# Altium schematic sheet 2020年电赛校赛电源板.SchDoc
size A4; DocumentNumber: 2; Revision: V2.0; SheetNumber: 2; SheetTotal: 5
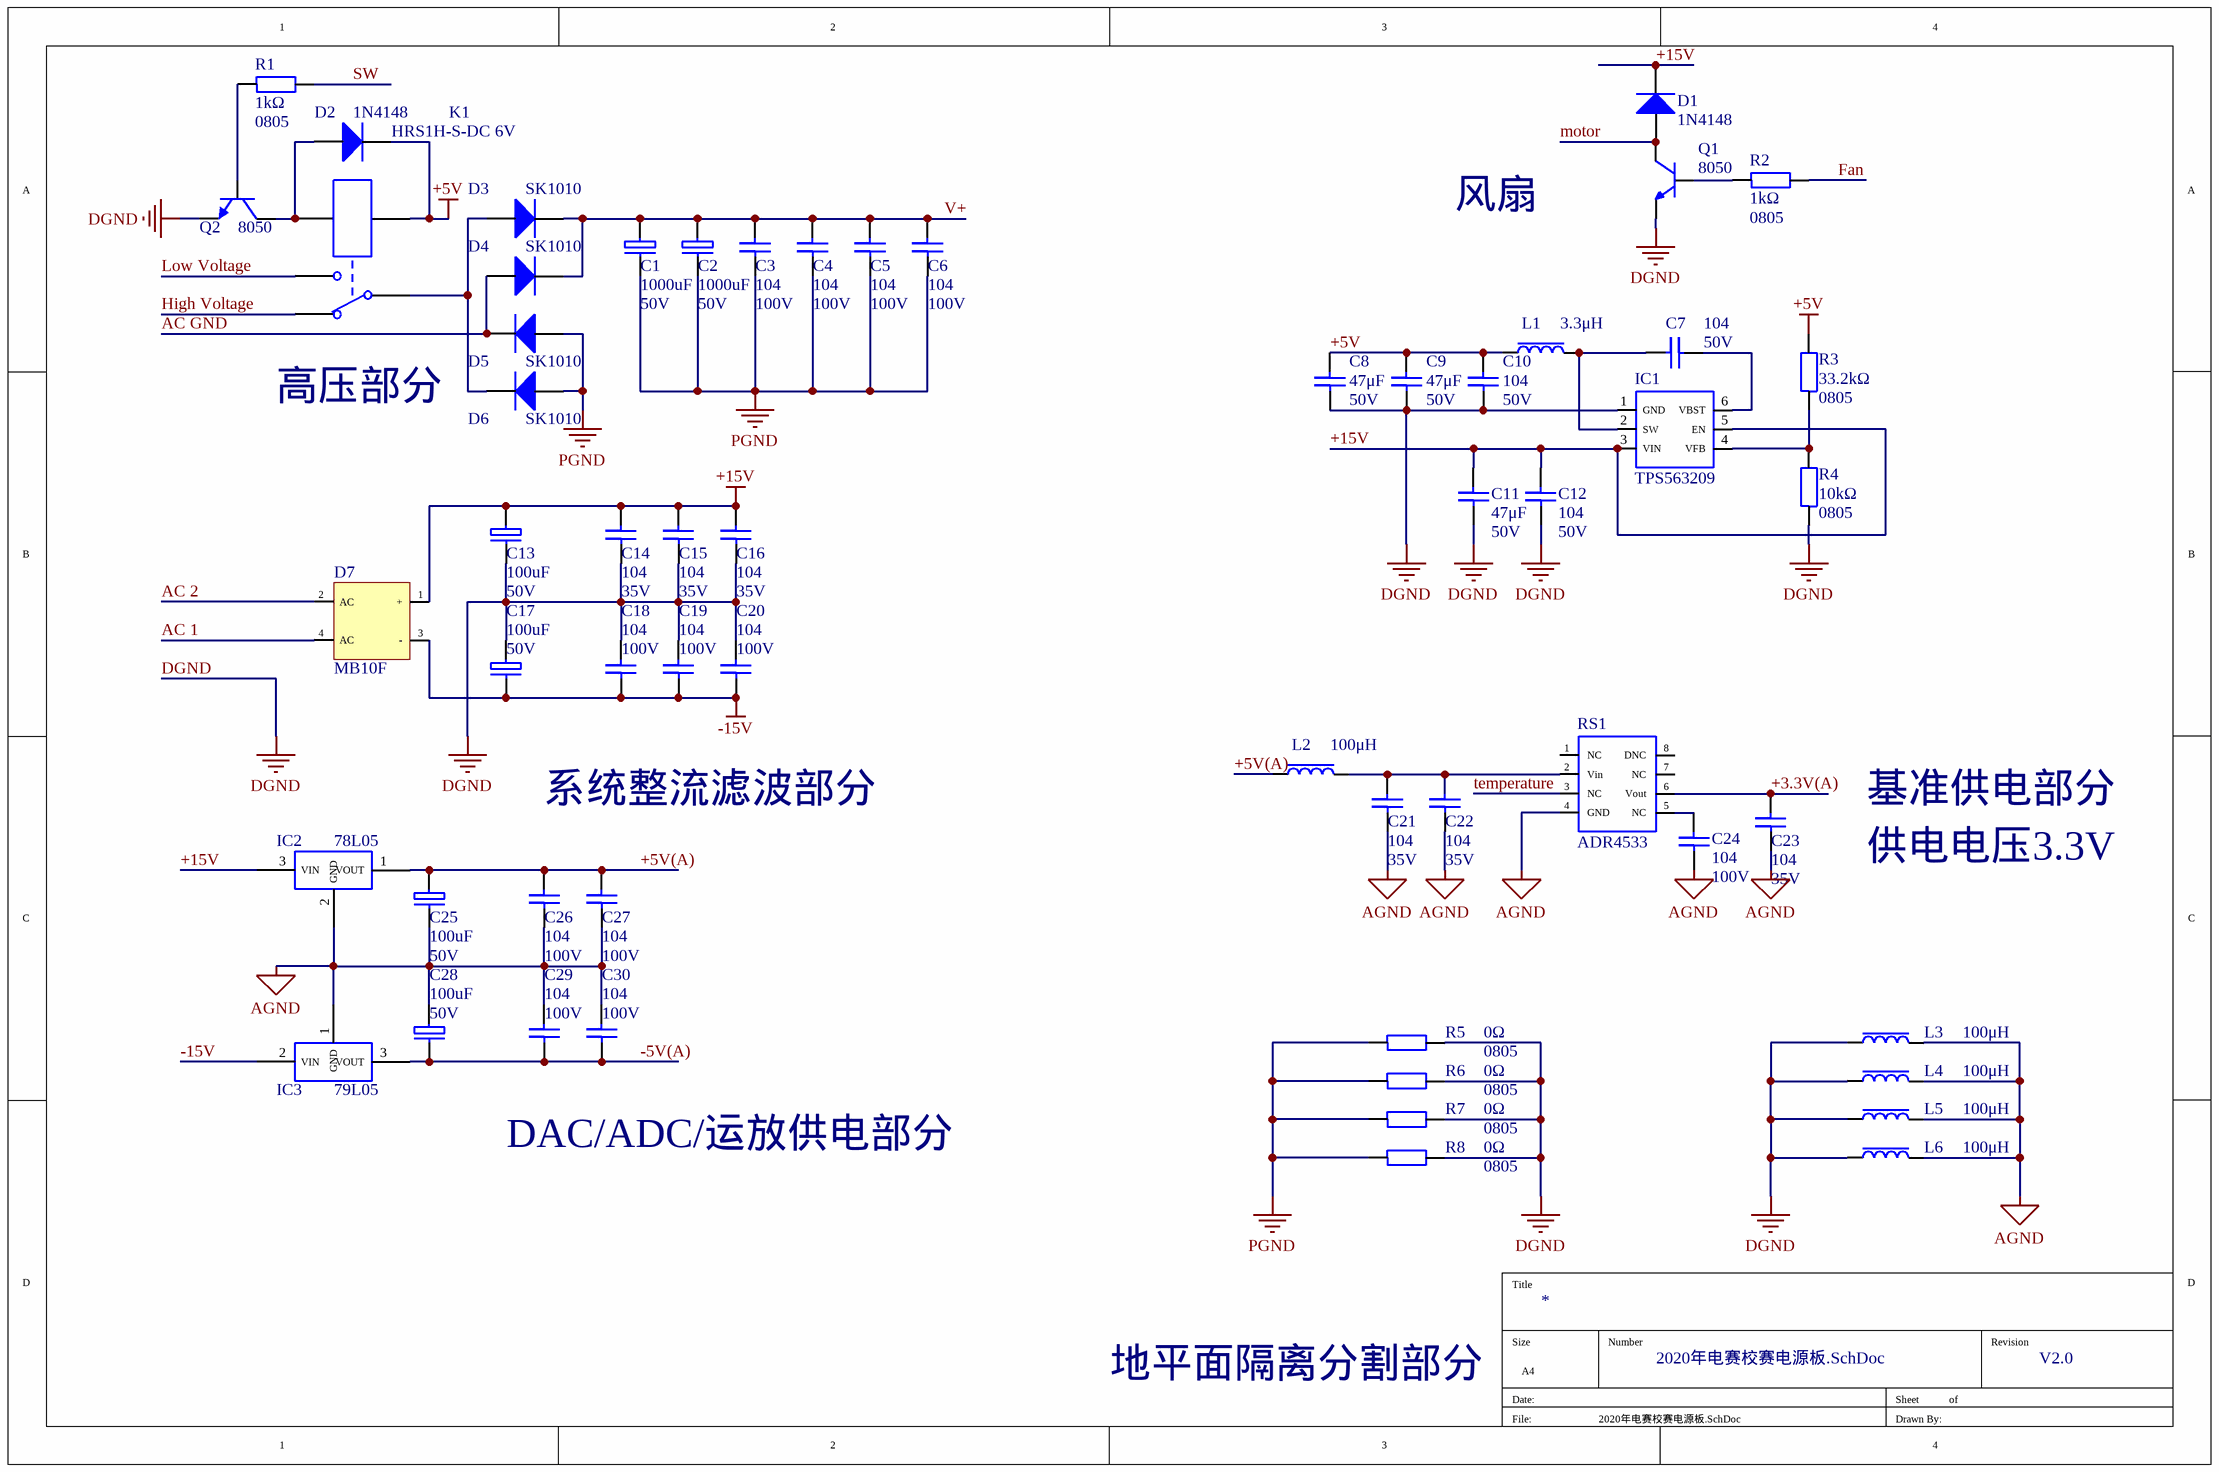
[diagram p0: 2020年电赛校赛电源板.SchDoc]

## Parts
C1  1000uF  value 50V  [50V 1000uF]
C2  1000uF  value 50V  [50V 1000uF]
C3  104  value 100V  [C0805]
C4  104  value 100V  [C0805]
C5  104  value 100V  [C0805]
C6  104  value 100V  [C0805]
C7  104  value 50V  [C0805]
C8  47μF  value 50V  [C1210]
C9  47μF  value 50V  [C1210]
C10  104  value 50V  [C0805]
C11  47μF  value 50V  [C1210]
C12  104  value 50V  [C0805]
C13  100uF  value 50V  [35V 470uF]
C14  104  value 35V  [C0805]
C15  104  value 35V  [C0805]
C16  104  value 35V  [C0805]
C17  100uF  value 50V  [35V 470uF]
C18  104  value 100V  [C0805]
C19  104  value 100V  [C0805]
C20  104  value 100V  [C0805]
C21  104  value 35V  [C0805]
C22  104  value 35V  [C0805]
C23  104  value 35V  [C0805]
C24  104  value 100V  [C0805]
C25  100uF  value 50V  [35V 470uF]
C26  104  value 100V  [C0805]
C27  104  value 100V  [C0805]
C28  100uF  value 50V  [35V 470uF]
C29  104  value 100V  [C0805]
C30  104  value 100V  [C0805]
D1  1N4148  [LL34]
D2  1N4148  [LL34]
D3  SK1010  [SMC(DO-214AB)]
D4  SK1010  [SMC(DO-214AB)]
D5  SK1010  [SMC(DO-214AB)]
D6  SK1010  [SMC(DO-214AB)]
D7  MB10F  [整流桥 SMD]
IC1  TPS563209  [TSOP-6]
IC2  78L05  [SOT-89]
IC3  79L05  [SOT-89]
K1  HRS1H-S-DC 6V  [HRS1H-S-DC 6V]
L1  3.3μH  [L0630]
L2  100μH  [R0805]
L3  100μH  [R0805]
L4  100μH  [R0805]
L5  100μH  [R0805]
L6  100μH  [R0805]
Q1  8050  [SOT-23]
Q2  8050  [SOT-23]
R1  1kΩ  value 0805  [R0805]
R2  1kΩ  value 0805  [R0805]
R3  33.2kΩ  value 0805  [R0805]
R4  10kΩ  value 0805  [R0805]
R5  0Ω  value 0805  [R0805]
R6  0Ω  value 0805  [R0805]
R7  0Ω  value 0805  [R0805]
R8  0Ω  value 0805  [R0805]
RS1  ADR4533  [SOP-8(体宽3.8mm)]

## Nets
+5V: C8.2 C9.2 C10.2 D2.2(K) K1.2 L1.2 R3.2
+15V: C11.2 C12.2 C13.1(+) C14.2 C15.2 C16.2 D1.2(K) D7.1(+) IC1.3(VIN) IC1.5(EN) IC2.3(VIN)
-15V: C17.2(-) C18.1 C19.1 C20.1 D7.3(-) IC3.2(VIN)
AGND: C21.1 C22.1 C23.1 C24.1 C25.2(-) C26.1 C27.1 C28.1(+) C29.2 C30.2 IC2.2(GND) IC3.1(GND) L3.1 L4.1 L5.1 L6.1 RS1.4(GND)
DGND: C8.1 C9.1 C10.1 C11.1 C12.1 C13.2(-) C14.1 C15.1 C16.1 C17.1(+) C18.2 C19.2 C20.2 IC1.1(GND) L3.2 L4.2 L5.2 L6.2 Q1.2(E) Q2.2(E) R4.1 R5.2 R6.2 R7.2 R8.2
PGND: C1.2(-) C2.2(-) C3.1 C4.1 C5.1 C6.1 D5.1(A) D6.1(A) R5.1 R6.1 R7.1 R8.1
+3.3V(A): C23.2 RS1.6(Vout)
+5V(A): C25.1(+) C26.2 C27.2 IC2.1(VOUT) L2.2
-5V(A): C28.2(-) C29.1 C30.1 IC3.3(VOUT)
AC 1: D7.4(AC)
AC 2: D7.2(AC)
AC GND: D4.1(A) D5.2(K)
Fan: R2.2
High Voltage: K1.1
Low Voltage: K1.6
motor: D1.1(A) Q1.3(C)
SW: R1.2
temperature: RS1.3(NC)
V+: C1.1(+) C2.1(+) C3.2 C4.2 C5.2 C6.2 D3.2(K) D4.2(K)
NetC7_1: C7.1 IC1.2(SW) L1.1
NetC7_2: C7.2 IC1.6(VBST)
NetC21_2: C21.2 C22.2 L2.1 RS1.2(Vin)
NetC24_2: C24.2 RS1.5(NC)
NetD2_1: D2.1(A) K1.5 Q2.3(C)
NetD3_1: D3.1(A) D6.2(K) K1.4
NetIC1_4: IC1.4(VFB) R3.1 R4.2
NetQ1_1: Q1.1(B) R2.1
NetQ2_1: Q2.1(B) R1.1

Not connected (* = marked no-connect by the designer): RS1 1(NC) 7(NC) 8(DNC)

## Notes on the sheet
- 风扇
- (near K1) 高压部分
- 系统整流滤波部分
- 基准供电部分
- 供电电压3.3V
- DAC/ADC/运放供电部分
- 地平面隔离分割部分

## Library data of the parts
C1 C2 C13 C17 C25 C28 = 100uF: 有极性电容
C3-C12 C14-C16 C18-C24 C26 C27 C29 C30 = 104: 无极性电容
D1-D6 = Diode: 二极管
D7 = MB10F: 1A 1000V整流桥
IC1 = TPS563209/563309: buck型电源管理
IC2 = AMS1117-3.3: LDO
IC3 = 790?: LDO
K1 = HRS1H-S-DC 6V: 继电器
L1-L6 = 470mH: 电感
Q1 = NPN!: 三极管
Q2 = NPN: 三极管
R1-R8 = 10kΩ: 贴片/直插电阻
RS1 = ADR4533: 高精度基准源